# Altium schematic sheet 1_P1.schdoc.schdoc
size 604 x 431 mm; Symbol: Sheet-Symbol_A4; Device: Sheet-Symbol_A4; Company: 嘉立创EDA; Version: V1.0; Page Size: A4; @Project Name: 复刻f1c100s/f1c200sLinux; @Page Count: 1; @Update Date: 2024-04-06; @Create Date: 2023-12-01; @Schematic Name: schematic1; @Page No: 1; @Page Name: P1
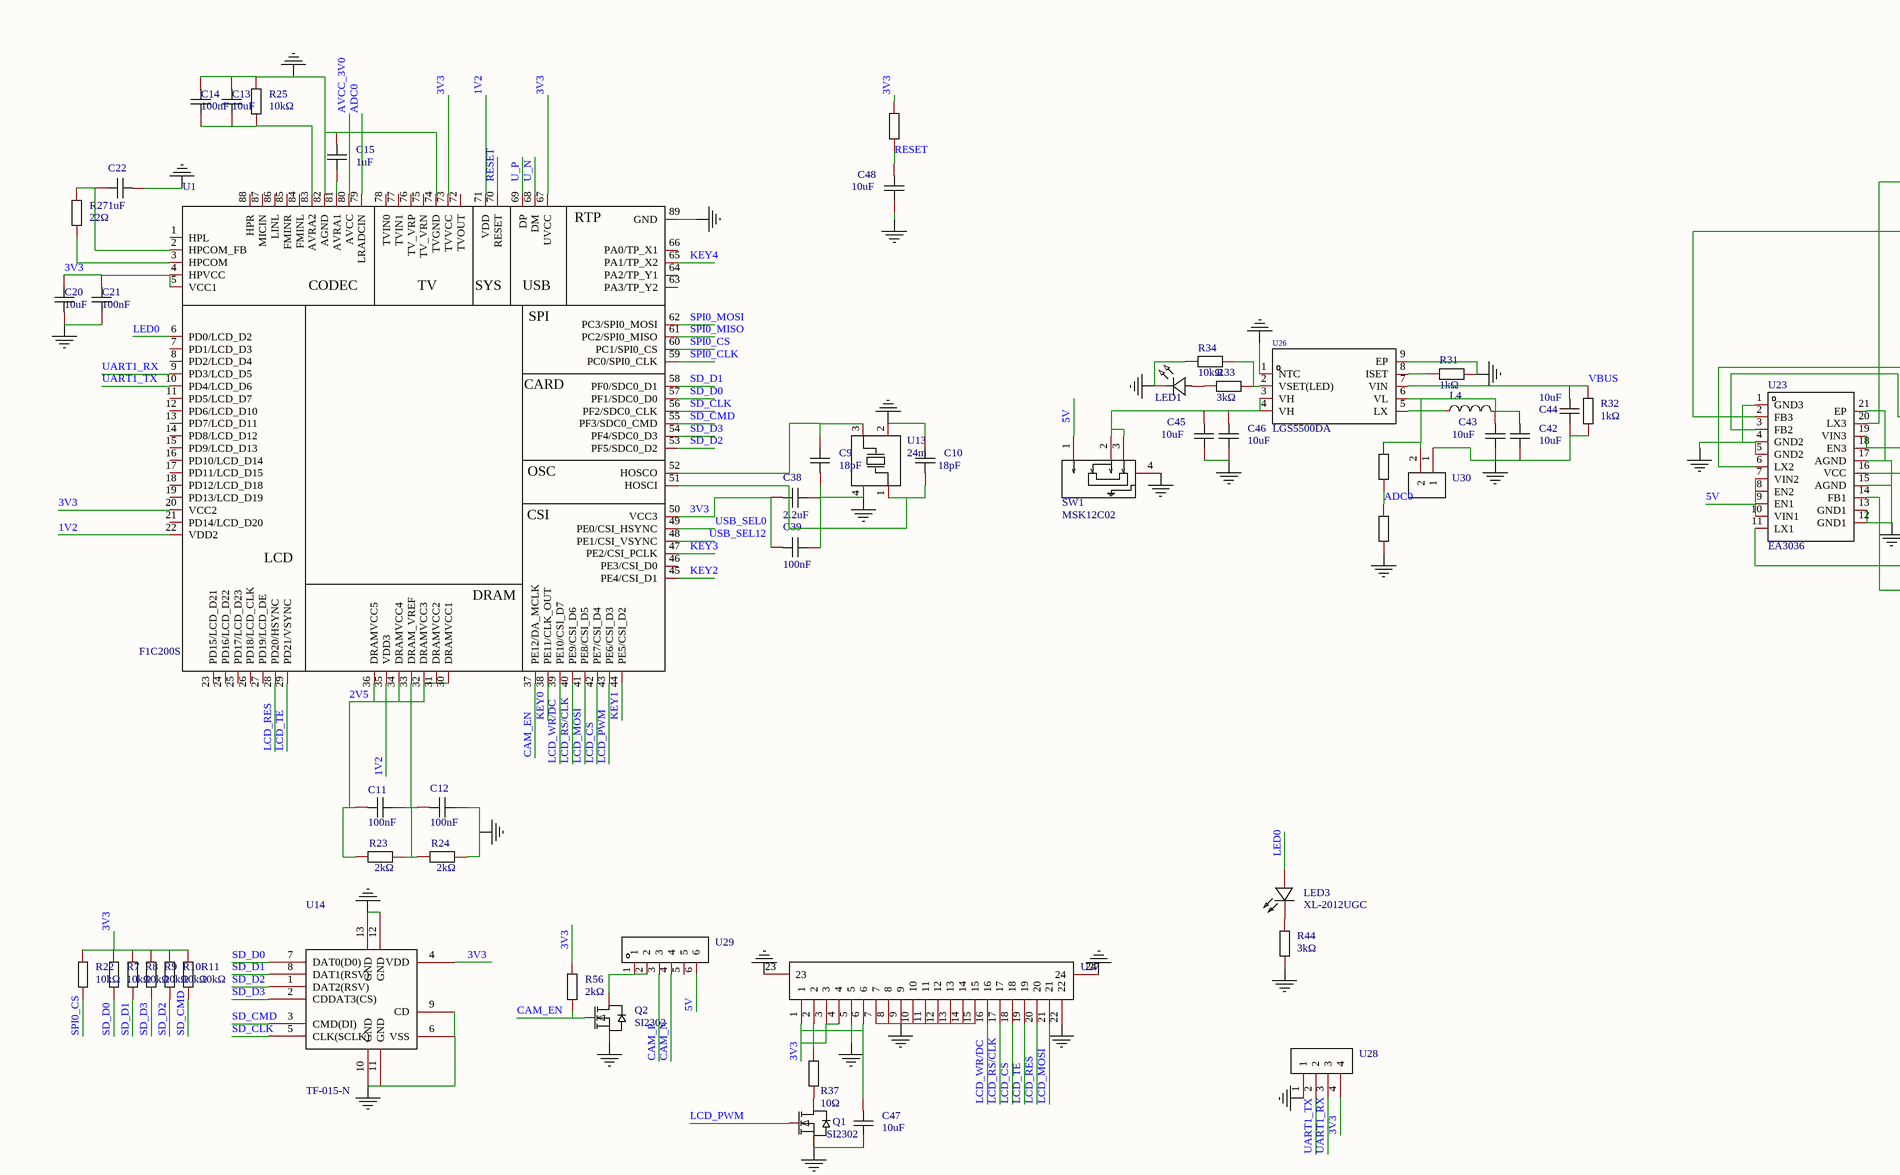
[diagram p0: 1_P1.schdoc.schdoc, top left]
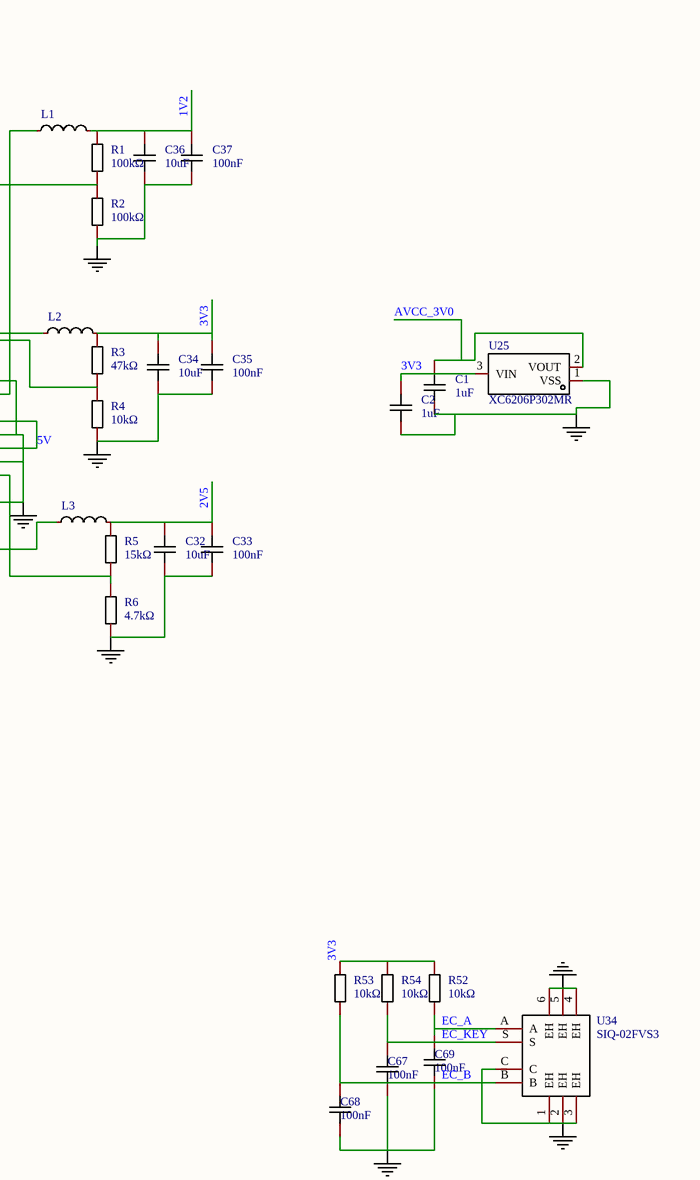
[diagram p1: 1_P1.schdoc.schdoc, top right]
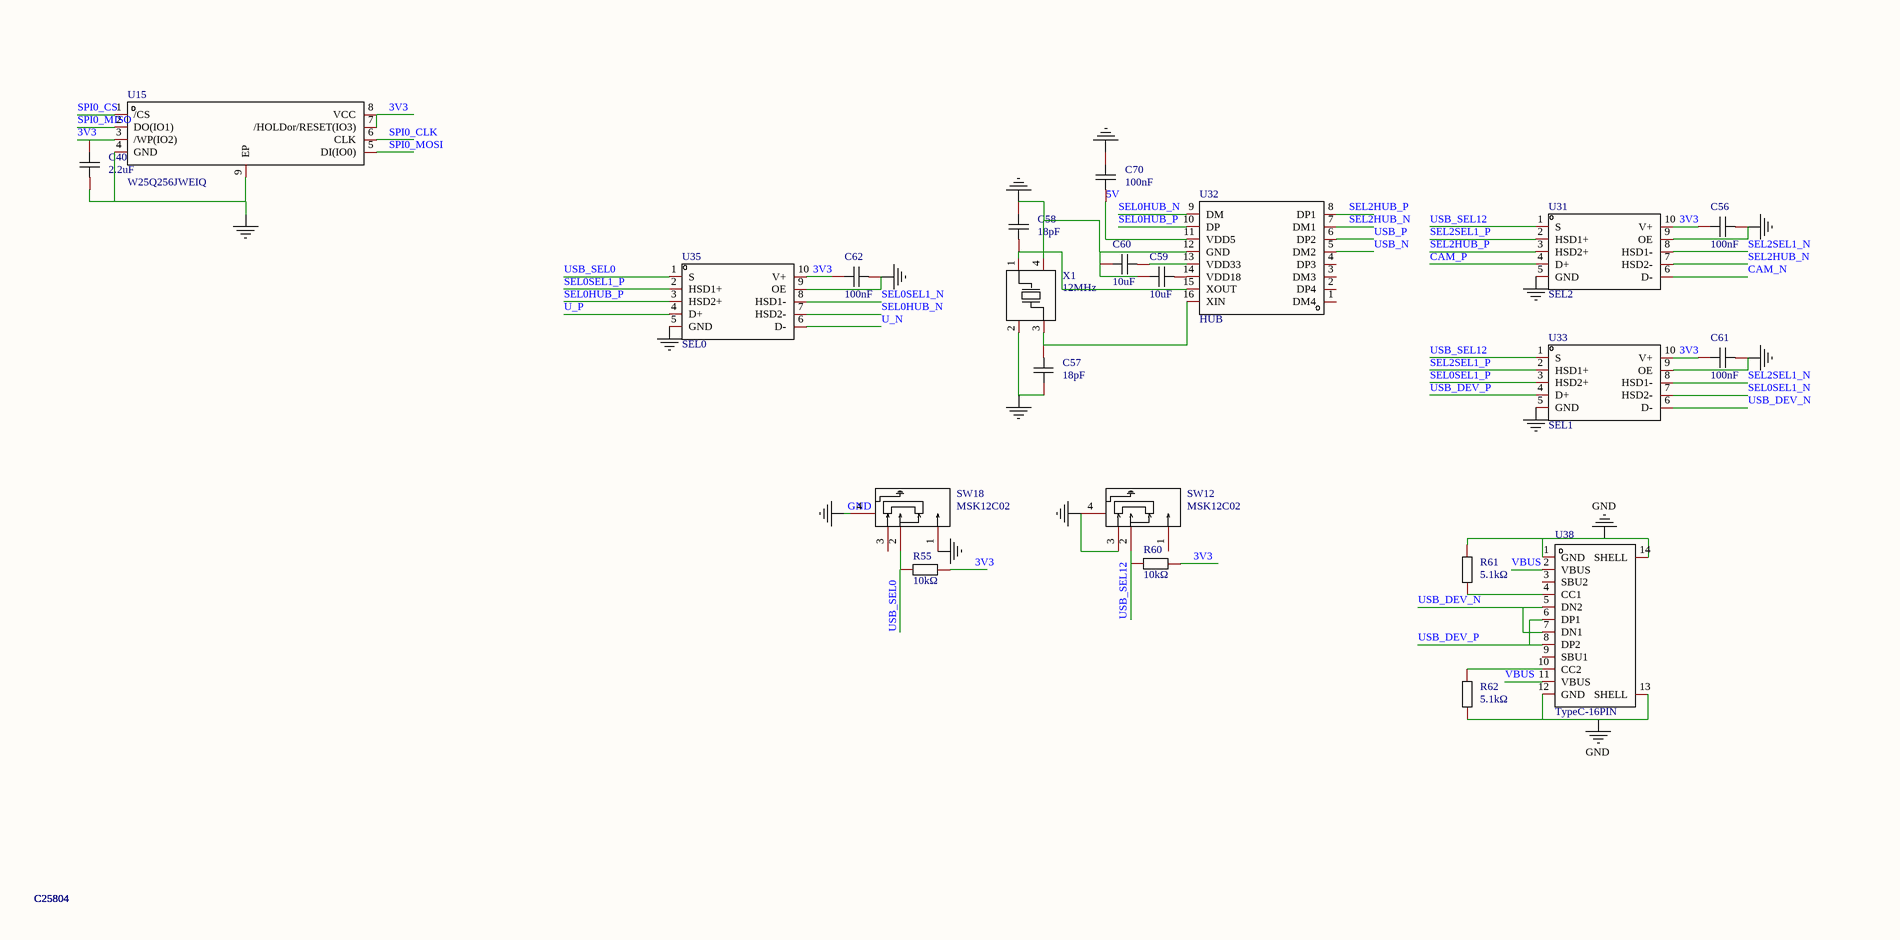
[diagram p2: 1_P1.schdoc.schdoc, bottom left]
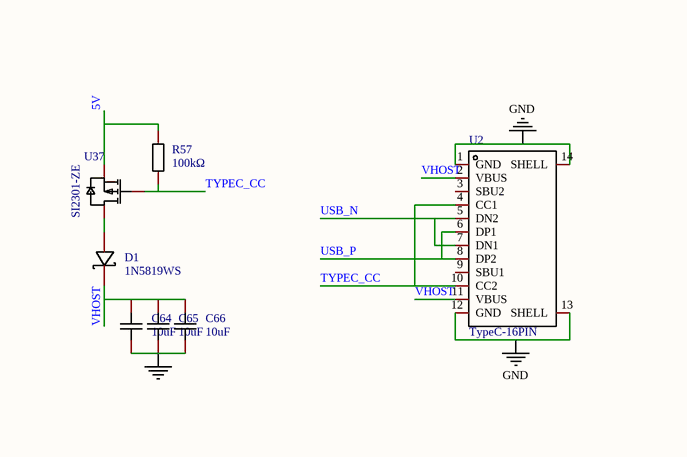
[diagram p3: 1_P1.schdoc.schdoc, bottom right]

## Parts
C1  1uF  [C0603]
C2  1uF  [C0603]
C9  18pF  [C0402]
C10  18pF  [C0402]
C11  100nF  [C0603]
C12  100nF  [C0603]
C13  10uF  [C0603]
C14  100nF  [C0603]
C15  1uF  [C0603]
C20  10uF  [C0603]
C21  100nF  [C0603]
C22  1uF  [C0603]
C32  10uF  [C0603]
C33  100nF  [C0603]
C34  10uF  [C0603]
C35  100nF  [C0603]
C36  10uF  [C0603]
C37  100nF  [C0603]
C38  2.2uF  [C0603]
C39  100nF  [C0603]
C40  2.2uF  [C0603]
C42  10uF  [C0603]
C43  10uF  [C0603]
C44  10uF  [C0603]
C45  10uF  [C0603]
C46  10uF  [C0603]
C47  10uF  [C0603]
C48  10uF  [C0603]
C56  100nF  [C0603]
C57  18pF  [C0402]
C58  18pF  [C0402]
C59  10uF  [C0603]
C60  10uF  [C0603]
C61  100nF  [C0603]
C62  100nF  [C0603]
C64  10uF  [C0603]
C65  10uF  [C0603]
C66  10uF  [C0603]
C67  100nF  [C0603]
C68  100nF  [C0603]
C69  100nF  [C0603]
C70  100nF  [C0603]
D1  1N5819WS  [SOD-323_L1.8-W1.3-LS2.5-RD]
L1  2.2uH  [IND-SMD_L2.5-W2.0_SWPA2520]  (value not drawn)
L2  2.2uH  [IND-SMD_L2.5-W2.0_SWPA2520]  (value not drawn)
L3  2.2uH  [IND-SMD_L2.5-W2.0_SWPA2520]  (value not drawn)
L4  2.2uH  [IND-SMD_L2.5-W2.0_SWPA2520]  (value not drawn)
LED1  XL-1608SURC-06  [LED0603-RD_RED]  (value not drawn)
LED3  XL-2012UGC  [LED0805-RD_GREEN]
Q1  SI2302  [SOT-23-3_L2.9-W1.3-P1.90-LS2.4-BR]
Q2  SI2302  [SOT-23-3_L2.9-W1.3-P1.90-LS2.4-BR]
R1  100kΩ  [R0603]
R2  100kΩ  [R0603]
R3  47kΩ  [R0603]
R4  10kΩ  [R0603]
R5  15kΩ  [R0603]
R6  4.7kΩ  [R0603]
R7  Supplier Part: C25804  [R0603]  (hidden comment: 10kΩ)
R8  Supplier Part: C25804  [R0603]  (hidden comment: 10kΩ)
R9  Supplier Part: C25804  [R0603]  (hidden comment: 10kΩ)
R10  Supplier Part: C25804  [R0603]  (hidden comment: 10kΩ)
R11  Supplier Part: C25804  [R0603]  (hidden comment: 10kΩ)
R12  10kΩ  [R0603]  (value not drawn)
R22  Supplier Part: C25804  [R0603]  (hidden comment: 10kΩ)
R23  2kΩ  [R0603]
R24  2kΩ  [R0603]
R25  10kΩ  [R0603]
R27  22Ω  [R0603]
R31  1kΩ  [R0603]
R32  1kΩ  [R0603]
R33  3kΩ  [R0603]
R34  10kΩ  [R0603]
R37  10Ω  [R0603]
R44  3kΩ  [R0603]
R50  10kΩ  [R0603]  (value not drawn)
R51  10kΩ  [R0603]  (value not drawn)
R52  10kΩ  [R0603]
R53  10kΩ  [R0603]
R54  10kΩ  [R0603]
R55  10kΩ  [R0603]
R56  2kΩ  [R0603]
R57  100kΩ  [R0603]
R60  10kΩ  [R0603]
R61  5.1kΩ  [R0603]
R62  5.1kΩ  [R0603]
SW1  MSK12C02  [SW-TH_MSK12C02]
SW12  MSK12C02  [SW-TH_MSK12C02]
SW18  MSK12C02  [SW-TH_MSK12C02]
U1  F1C200S  [QFN-88_L10.0-W10.0-P0.40-BL-EP6.75]
U2  TypeC-16PIN  [USB-C-SMD_TYPE-C-6PIN-2MD-073]
U13  24m  [CRYSTAL-SMD_4P-L3.2-W2.5-BL_SIT8008BI]
U14  TF-015-N  [TF-SMD_TF-015]
U15  W25Q256JWEIQ  [WSON-8_L8.0-W6.0-P1.27-TL-EP]
U23  EA3036  [QFN-20_L3.0-W3.0-P0.40-TL-EP1.7]
U25  XC6206P302MR  [SOT-23-3_L3.0-W1.7-P0.95-LS2.9-BR]
U26  LGS5500DA  [DFN-8_L2.0-W2.0-P0.50-TL-EP]
U27  2.0寸ips  [2.0寸ips]  (value not drawn)
U28  UART2.54  [uart2.54]  (value not drawn)
U29  ir  [ir]  (value not drawn)
U30  bat  [bat]  (value not drawn)
U31  SEL2  [MSOP-10_L3.0-W3.0-P0.50-LS5.0-BL]
U32  HUB  [SOP-16_L10.0-W3.9-P1.27-LS6.0-BL]
U33  SEL1  [MSOP-10_L3.0-W3.0-P0.50-LS5.0-BL]
U34  SIQ-02FVS3  [SW-SMD_SIQ-02FVS3_1]
U35  SEL0  [MSOP-10_L3.0-W3.0-P0.50-LS5.0-BL]
U37  SI2301-ZE  [SOT-23-3_L2.9-W1.3-P1.90-LS2.4-BR]
U38  TypeC-16PIN  [USB-C-SMD_TYPE-C-6PIN-2MD-073]
X1  12MHz  [OSC-SMD_4P-L3.2-W2.5-BL]

## Nets
GND: C1.1 C2.1 C9.2 C10.1 C12.1 C13.2 C14.2 C15.2 C20.2 C21.1 C22.2 C32.2 C33.2 C34.2 C35.2 C36.2 C37.2 C38.1 C39.1 C40.2 C42.1 C43.1 C44.1 C45.1 C46.1 C47.1 C48.1 C56.2 C57.1 C58.1 C59.1 C60.1 C61.2 C62.2 C64.2 C65.2 C66.2 C67.1 C68.1 C69.1 C70.1 LED1.1(K) Q1.2(S) Q2.2(S) R2.1 R4.1 R6.1 R24.2 R25.1 R31.2 R32.1 R34.1 R44.2 R51.1 R61.1 R62.1 SW1.4 SW12.3 SW12.4 SW18.1 SW18.4 U1.74(TVGND) U1.82(AGND) U1.89(GND) U2.1(GND) U2.12(GND) U2.13(SHELL) U2.14(SHELL) U13.2(GND) U13.4(GND) U14.6(VSS) U14.9(CD) U14.10(GND) U14.11(GND) U14.12(GND) U14.13(GND) U15.4(GND) U15.9(EP) U23.1(GND3) U23.4(GND2) U23.5(GND2) U23.12(GND1) U23.13(GND1) U23.15(AGND) U23.17(AGND) U23.21(EP) U25.1(VSS) U26.1(NTC) U26.9(EP) U27.5 U27.7 U27.8 U27.9 U27.10 U27.11 U27.12 U27.13 U27.14 U27.15 U27.22 U27.23 U27.24 U28.1 U30.1 U31.5(GND) U31.9(OE) U32.12(GND) U33.5(GND) U33.9(OE) U34.1(EH) U34.2(EH) U34.3(EH) U34.4(EH) U34.5(EH) U34.6(EH) U34.C U35.5(GND) U35.9(OE) U38.1(GND) U38.12(GND) U38.13(SHELL) U38.14(SHELL) X1.2(GND) X1.4(GND)
1V2: C36.1 C37.1 L1.2 R1.2 U1.22(VDD2) U1.35(VDD3) U1.71(VDD)
2V5: C11.2 C32.1 C33.1 L3.2 R5.2 R23.1 U1.30(DRAMVCC1) U1.31(DRAMVCC2) U1.32(DRAMVCC3) U1.34(DRAMVCC4) U1.36(DRAMVCC5)
3V3: C2.2 C20.1 C21.2 C34.1 C35.1 C38.2 C39.2 C40.1 C47.2 C56.1 C61.1 C62.1 L2.2 R3.2 R7.2 R8.2 R9.2 R10.2 R11.2 R12.2 R22.2 R52.2 R53.2 R54.2 R55.1 R56.2 R60.1 U1.4(HPVCC) U1.5(VCC1) U1.20(VCC2) U1.50(VCC3) U1.67(UVCC) U1.73(TVVCC) U14.4(VDD) U15.3(/WP(IO2)) U15.7(/HOLDor/RESET(IO3)) U15.8(VCC) U25.3(VIN) U27.1 U27.3 U27.4 U27.6 U28.4 U31.10(V+) U33.10(V+) U35.10(V+)
5V: C70.2 R57.1 SW1.1 U23.7(VIN2) U23.8(EN2) U23.9(EN1) U23.10(VIN1) U23.16(VCC) U23.18(EN3) U23.19(VIN3) U29.6 U32.11(VDD5) U37.2(S)
ADC0: R50.1 R51.2 U1.79(LRADCIN)
AVCC_3V0: C1.2 U1.80(AVCC) U25.2(VOUT)
CAM_EN: Q2.1(G) R56.1 U1.37(PE12/DA_MCLK)
CAM_N: U29.4 U31.6(D-)
CAM_P: U29.3 U31.4(D+)
EC_A: C69.2 R52.1 U34.A
EC_B: C68.2 R53.1 U34.B
EC_KEY: C67.2 R54.1 U34.S
KEY0: U1.38(PE11/CLK_OUT)
KEY1: U1.44(PE5/CSI_D2)
KEY2: U1.45(PE4/CSI_D1)
KEY3: U1.47(PE2/CSI_PCLK)
KEY4: U1.65(PA1/TP_X2)
LCD_CS: U1.42(PE7/CSI_D4) U27.18
LCD_MOSI: U1.41(PE8/CSI_D5) U27.21
LCD_PWM: Q1.1(G) U1.43(PE6/CSI_D3)
LCD_RES: U1.28(PD20/HSYNC) U27.20
LCD_RS/CLK: U1.40(PE9/CSI_D6) U27.17
LCD_TE: U1.29(PD21/VSYNC) U27.19
LCD_WR/DC: U1.39(PE10/CSI_D7) U27.16
LED0: LED3.1(+) U1.6(PD0/LCD_D2)
RESET: C48.2 R12.1 U1.70(RESET)
SD_CLK: U1.56(PF2/SDC0_CLK) U14.5(CLK(SCLK))
SD_CMD: R11.1 U1.55(PF3/SDC0_CMD) U14.3(CMD(DI))
SD_D0: R7.1 U1.57(PF1/SDC0_D0) U14.7(DAT0(D0))
SD_D1: R8.1 U1.58(PF0/SDC0_D1) U14.8(DAT1(RSV))
SD_D2: R10.1 U1.53(PF5/SDC0_D2) U14.1(DAT2(RSV))
SD_D3: R9.1 U1.54(PF4/SDC0_D3) U14.2(CDDAT3(CS))
SEL0HUB_N: U32.9(DM) U35.7(HSD2-)
SEL0HUB_P: U32.10(DP) U35.3(HSD2+)
SEL0SEL1_N: U33.7(HSD2-) U35.8(HSD1-)
SEL0SEL1_P: U33.3(HSD2+) U35.2(HSD1+)
SEL2HUB_N: U31.7(HSD2-) U32.7(DM1)
SEL2HUB_P: U31.3(HSD2+) U32.8(DP1)
SEL2SEL1_N: U31.8(HSD1-) U33.8(HSD1-)
SEL2SEL1_P: U31.2(HSD1+) U33.2(HSD1+)
SPI0_CLK: U1.59(PC0/SPI0_CLK) U15.6(CLK)
SPI0_CS: R22.1 U1.60(PC1/SPI0_CS) U15.1(/CS)
SPI0_MISO: U1.61(PC2/SPI0_MISO) U15.2(DO(IO1))
SPI0_MOSI: U1.62(PC3/SPI0_MOSI) U15.5(DI(IO0))
TYPEC_CC: R57.2 U2.4(CC1) U2.10(CC2) U37.1(G)
U_N: U1.68(DM) U35.6(D-)
U_P: U1.69(DP) U35.4(D+)
UART1_RX: U1.9(PD3/LCD_D5) U28.3
UART1_TX: U1.10(PD4/LCD_D6) U28.2
USB_DEV_N: U33.6(D-) U38.5(DN2) U38.7(DN1)
USB_DEV_P: U33.4(D+) U38.6(DP1) U38.8(DP2)
USB_N: U2.5(DN2) U2.7(DN1) U32.5(DM2)
USB_P: U2.6(DP1) U2.8(DP2) U32.6(DP2)
USB_SEL0: R55.2 SW18.2 U1.49(PE0/CSI_HSYNC) U35.1(S)
USB_SEL12: R60.2 SW12.2 U1.48(PE1/CSI_VSYNC) U31.1(S) U33.1(S)
VBUS: C44.2 R32.2 U26.7(VIN) U38.2(VBUS) U38.11(VBUS)
VHOST: C64.1 C65.1 C66.1 D1.1(K) U2.2(VBUS) U2.11(VBUS)
NetC9_1: C9.1 U1.52(HOSCO) U13.3(OSC2)
NetC10_2: C10.2 U1.51(HOSCI) U13.1(OSC1)
NetC11_1: C11.1 C12.2 R23.2 R24.1 U1.33(DRAM_VREF)
NetC13_1: C13.1 C14.1 R25.2 U1.83(AVRA2)
NetC15_1: C15.1 U1.81(AVRA1)
NetC22_1: C22.1 R27.2 U1.2(HPCOM_FB)
NetC42_2: C42.2 C43.2 L4.2 R50.2 U26.6(VL) U30.2
NetC45_2: C45.2 C46.2 SW1.2 SW1.3 U26.3(VH) U26.4(VH)
NetC57_2: C57.2 U32.16(XIN) X1.3(OSC2)
NetC58_2: C58.2 U32.15(XOUT) X1.1(OSC1)
NetC59_2: C59.2 U32.14(VDD18)
NetC60_2: C60.2 U32.13(VDD33)
NetD1_2: D1.2(A) U37.3(D)
NetL1_1: L1.1 U23.20(LX3)
NetL2_1: L2.1 U23.6(LX2)
NetL3_1: L3.1 U23.11(LX1)
NetL4_1: L4.1 U26.5(LX)
NetLED1_2: LED1.2(A) R33.2
NetLED3_2: LED3.2(-) R44.1
NetQ1_3: Q1.3(D) R37.1
NetQ2_3: Q2.3(D) U29.1 U29.2
NetR1_1: R1.1 R2.2 U23.2(FB3)
NetR3_1: R3.1 R4.2 U23.3(FB2)
NetR5_1: R5.1 R6.2 U23.14(FB1)
NetR27_1: R27.1 U1.3(HPCOM)
NetR31_1: R31.1 U26.8(ISET)
NetR33_1: R33.1 R34.2 U26.2(VSET(LED))
NetR37_2: R37.2 U27.2
NetR61_2: R61.2 U38.4(CC1)
NetR62_2: R62.2 U38.10(CC2)

Not connected (* = marked no-connect by the designer): SW12 1; SW18 3; U1 1(HPL) 7(PD1/LCD_D3) 8(PD2/LCD_D4) 11(PD5/LCD_D7) 12(PD6/LCD_D10) 13(PD7/LCD_D11) 14(PD8/LCD_D12) 15(PD9/LCD_D13) 16(PD10/LCD_D14) 17(PD11/LCD_D15) 18(PD12/LCD_D18) 19(PD13/LCD_D19) 21(PD14/LCD_D20) 23(PD15/LCD_D21) 24(PD16/LCD_D22) 25(PD17/LCD_D23) 26(PD18/LCD_CLK) 27(PD19/LCD_DE) 46(PE3/CSI_D0) 63(PA3/TP_Y2) 64(PA2/TP_Y1) 66(PA0/TP_X1) 72(TVOUT) 75(TV_VRN) 76(TV_VRP) 77(TVIN1) 78(TVIN0) 84(FMINL) 85(FMINR) 86(LINL) 87(MICIN) 88(HPR); U2 3(SBU2) 9(SBU1); U29 5; U32 1(DM4) 2(DP4) 3(DM3) 4(DP3); U38 3(SBU2) 9(SBU1)

## Notes on the sheet
- 1
- 2
- 3
- 4
- 5
- 6
- A
- B
- C
- D
- Schematic
- schematic1
- Create Date
- Update Date
- 2024-04-06
- 2023-12-01
- Reviewed
- Drawed
- Page
- P1
- Part Number
- 复刻f1c100s/f1c200sLinux
- VER
- SIZE
- PAGE
- OF
- V1.0
- A4
- 嘉立创EDA
- (in symbol F1C200S) RTP; CODEC; TV; SYS; USB; SPI; CARD; OSC; CSI; LCD; DRAM

## Library data of the parts
C1 C2 C15 C22 = CL10A105KB8NNNC: Manufacturer: SAMSUNG(三星); Symbol: C1608JB1C105K080AA; Add into BOM: yes; Tolerance: ±10%; Voltage Rated: 50V; Temperature Coefficient: X5R; Description: 容值:1uF;精度:±10%;额定电压:50V;材质(温度系数):X5R;; Name: 1uF; Device: CL10A105KB8NNNC; LCSC Part Name: 1uF ±10% 50V; Supplier Part: C15849; Manufacturer Part: CL10A105KB8NNNC; Supplier Footprint: 0603; JLCPCB Part Class: Basic Part; Datasheet: https://atta.szlcsc.com/upload/public/pdf/source/20160218/1457707763339.pdf; Supplier: LCSC; Convert to PCB: yes; Value: 1uF
C9 C10 C57 C58 = 0402CG180J500NT: Manufacturer: FH(风华); Symbol: C1608JB1C105K080AA; Add into BOM: yes; Tolerance: ±5%; Voltage Rated: 50V; Temperature Coefficient: C0G; Description: 容值:18pF;精度:±5%;额定电压:50V;材质(温度系数):C0G;; Name: 18pF; Device: 0402CG180J500NT; LCSC Part Name: 18pF ±5% 50V; Supplier Part: C1549; Manufacturer Part: 0402CG180J500NT; Supplier Footprint: 0402; JLCPCB Part Class: Basic Part; Datasheet: https://atta.szlcsc.com/upload/public/pdf/source/20200305/C486355_26A10D38EF8C2A5C37091D0039909270.pdf; Supplier: LCSC; Convert to PCB: yes; Value: 18pF
C11 C12 = 0603B104K500NT: Manufacturer: FH(风华); Symbol: CL05A106MQ5NUNZ; Add into BOM: yes; Tolerance: ±10%; Voltage Rated: 50V; Temperature Coefficient: X7R; Description: 容值:100nF;精度:±10%;额定电压:50V;材质(温度系数):X7R;; Name: 100nF; Device: 0603B104K500NT; LCSC Part Name: 100nF ±10% 50V; Supplier Part: C30926; Manufacturer Part: 0603B104K500NT; Supplier Footprint: 0603; JLCPCB Part Class: Extended Part; Datasheet: https://atta.szlcsc.com/upload/public/pdf/source/20200305/C486355_26A10D38EF8C2A5C37091D0039909270.pdf; Supplier: LCSC; Convert to PCB: yes; Value: 100nF
C13 = CL10A106MA8NRNC: Manufacturer: SAMSUNG(三星); Symbol: C1608JB1C105K080AA; Add into BOM: yes; Tolerance: ±20%; Voltage Rated: 25V; Temperature Coefficient: X5R; Description: 容值:10uF;精度:±20%;额定电压:25V;材质(温度系数):X5R;; Name: 10uF; Device: CL10A106MA8NRNC; LCSC Part Name: 10uF ±20% 25V; Supplier Part: C96446; Manufacturer Part: CL10A106MA8NRNC; Supplier Footprint: 0603; JLCPCB Part Class: Basic Part; Datasheet: https://atta.szlcsc.com/upload/public/pdf/source/20160218/1457707763339.pdf; Supplier: LCSC; Convert to PCB: yes; Value: 10uF
C14 = 0603B104K500NT: Manufacturer: FH(风华); Symbol: C1608JB1C105K080AA; Add into BOM: yes; Tolerance: ±10%; Voltage Rated: 50V; Temperature Coefficient: X7R; Description: 容值:100nF;精度:±10%;额定电压:50V;材质(温度系数):X7R;; Name: 100nF; Device: 0603B104K500NT; LCSC Part Name: 100nF ±10% 50V; Supplier Part: C30926; Manufacturer Part: 0603B104K500NT; Supplier Footprint: 0603; JLCPCB Part Class: Extended Part; Datasheet: https://atta.szlcsc.com/upload/public/pdf/source/20200305/C486355_26A10D38EF8C2A5C37091D0039909270.pdf; Supplier: LCSC; Convert to PCB: yes; Value: 100nF
C20 = CL10A106MA8NRNC: Manufacturer: SAMSUNG(三星); Symbol: CGB2A1X6S1A105M033BC; Add into BOM: yes; Tolerance: ±20%; Voltage Rated: 25V; Temperature Coefficient: X5R; Description: 容值:10uF;精度:±20%;额定电压:25V;材质(温度系数):X5R;; Name: 10uF; Device: CL10A106MA8NRNC; LCSC Part Name: 10uF ±20% 25V; Supplier Part: C96446; Manufacturer Part: CL10A106MA8NRNC; Supplier Footprint: 0603; JLCPCB Part Class: Basic Part; Datasheet: https://atta.szlcsc.com/upload/public/pdf/source/20160218/1457707763339.pdf; Supplier: LCSC; Convert to PCB: yes; Value: 10uF
C21 C67-C69 = 0603B104K500NT: Manufacturer: FH(风华); Symbol: CGB2A1X6S1A105M033BC; Add into BOM: yes; Tolerance: ±10%; Voltage Rated: 50V; Temperature Coefficient: X7R; Description: 容值:100nF;精度:±10%;额定电压:50V;材质(温度系数):X7R;; Name: 100nF; Device: 0603B104K500NT; LCSC Part Name: 100nF ±10% 50V; Supplier Part: C30926; Manufacturer Part: 0603B104K500NT; Supplier Footprint: 0603; JLCPCB Part Class: Extended Part; Datasheet: https://atta.szlcsc.com/upload/public/pdf/source/20200305/C486355_26A10D38EF8C2A5C37091D0039909270.pdf; Supplier: LCSC; Convert to PCB: yes; Value: 100nF
C32 C34 C36 C64-C66 = CL10A106MA8NRNC: Manufacturer: SAMSUNG(三星); Symbol: CC0603KRX7R9BB104; Add into BOM: yes; Tolerance: ±20%; Voltage Rated: 25V; Temperature Coefficient: X5R; Description: 容值:10uF;精度:±20%;额定电压:25V;材质(温度系数):X5R;; Name: 10uF; Device: CL10A106MA8NRNC; LCSC Part Name: 10uF ±20% 25V; Supplier Part: C96446; Manufacturer Part: CL10A106MA8NRNC; Supplier Footprint: 0603; JLCPCB Part Class: Basic Part; Datasheet: https://atta.szlcsc.com/upload/public/pdf/source/20160218/1457707763339.pdf; Supplier: LCSC; Convert to PCB: yes; Value: 10uF
C33 C35 C37 C39 C56 C61 C62 C70 = 0603B104K500NT: Manufacturer: FH(风华); Symbol: CC0603KRX7R9BB104; Add into BOM: yes; Tolerance: ±10%; Voltage Rated: 50V; Temperature Coefficient: X7R; Description: 容值:100nF;精度:±10%;额定电压:50V;材质(温度系数):X7R;; Name: 100nF; Device: 0603B104K500NT; LCSC Part Name: 100nF ±10% 50V; Supplier Part: C30926; Manufacturer Part: 0603B104K500NT; Supplier Footprint: 0603; JLCPCB Part Class: Extended Part; Datasheet: https://atta.szlcsc.com/upload/public/pdf/source/20200305/C486355_26A10D38EF8C2A5C37091D0039909270.pdf; Supplier: LCSC; Convert to PCB: yes; Value: 100nF
C38 C40 = CL10A225KO8NNNC: Manufacturer: SAMSUNG(三星); Symbol: CC0603KRX7R9BB104; Add into BOM: yes; Tolerance: ±10%; Voltage Rated: 16V; Temperature Coefficient: X5R; Description: 容值:2.2uF;精度:±10%;额定电压:16V;材质(温度系数):X5R;; Name: 2.2uF; Device: CL10A225KO8NNNC; LCSC Part Name: 2.2uF ±10% 16V; Supplier Part: C23630; Manufacturer Part: CL10A225KO8NNNC; Supplier Footprint: 0603; JLCPCB Part Class: Basic Part; Datasheet: https://atta.szlcsc.com/upload/public/pdf/source/20160218/1457707763339.pdf; Supplier: LCSC; Convert to PCB: yes; Value: 2.2uF
C42-C48 C59 C60 = CL10A106MA8NRNC: Manufacturer: SAMSUNG(三星); Symbol: CL10A106KP8NNNC; Add into BOM: yes; Tolerance: ±20%; Voltage Rated: 25V; Temperature Coefficient: X5R; Description: 容值:10uF;精度:±20%;额定电压:25V;材质(温度系数):X5R;; Name: 10uF; Device: CL10A106MA8NRNC; Supplier: LCSC; Manufacturer Part: CL10A106MA8NRNC; Value: 10uF; Supplier Part: C96446; JLCPCB Part Class: Basic Part; LCSC Part Name: 10uF ±20% 25V; Supplier Footprint: 0603; Datasheet: https://atta.szlcsc.com/upload/public/pdf/source/20160218/1457707763339.pdf; Convert to PCB: yes
D1 = 1N5819WS_C191023: Manufacturer: Hottech(合科泰); Add into BOM: yes; Forward Voltage (Vf@If): 600mV@1A; Reverse Voltage (Vr): 40V; Average Rectified Current (Io): 1A; Description: 正向压降(Vf):600mV@1A;直流反向耐压(Vr):40V;平均整流电流(Io):1A;; Name: 1N5819WS; Symbol: 1N5819WS; Device: 1N5819WS_C191023; Supplier: LCSC; Supplier Part: C191023; Manufacturer Part: 1N5819WS; JLCPCB Part Class: 基础库; LCSC Part Name: 电压:40V 电流:1A; Supplier Footprint: SOD-323; Datasheet: https://atta.szlcsc.com/upload/public/pdf/source/20220428/3CB86FD8D28D653594B4E35F9D5AEFD9.pdf; Convert to PCB: yes
L1-L4 = CMLW252012S2R2MST: Manufacturer: Cybermax(思博科技); Add into BOM: yes; Tolerance: ±20%; Rated Current: 1.85A; DC Resistance (DCR): 130mΩ; Description: 电感值:2.2uH;精度:±20%;额定电流:1.85A;直流电阻(DCR):130mΩ;; Name: 2.2uH; Symbol: CMLW252012S2R2MST; Device: CMLW252012S2R2MST; LCSC Part Name: 2.2uH ±20% 1.85A 130mΩ; Supplier Part: C411361; Manufacturer Part: CMLW252012S2R2MST; Supplier Footprint: SMD; JLCPCB Part Class: Extended Part; Datasheet: https://atta.szlcsc.com/upload/public/pdf/source/20190812/C411361_857CB3F99B232DE0F7EEA04983950F98.pdf; Supplier: LCSC; Convert to PCB: yes; Value: 2.2uH
LED1 = XL-1608SURC-06: Manufacturer: XINGLIGHT(成兴光); Add into BOM: yes; Emitted Color: 红灯; Lens Color: 无色透明; Dominant Wavelength: 617nm~621nm; Peak Wavelength: 623nm; Forward Current: 25mA; Power Dissipation: 55mW; Viewing Angle: 120°; Mounting Sytle: 正贴; Description: 发光颜色:红灯;主波长:617nm~621nm;色温:-;功率:55mW;安装方式:正贴;; Name: XL-1608SURC-06; Symbol: XL-1608SURC-06; Device: XL-1608SURC-06; LCSC Part Name: 红灯 正贴; Supplier Part: C965799; Manufacturer Part: XL-1608SURC-06; Supplier Footprint: 0603; JLCPCB Part Class: Extended Part; Datasheet: https://atta.szlcsc.com/upload/public/pdf/source/20221102/D860AFDD1CDB02C5A8064103A32707E2.pdf; Supplier: LCSC; Convert to PCB: yes; Color Temperature: -; Operating Temperature: -30℃~+85℃
LED3 = XL-2012UGC: Manufacturer: XINGLIGHT(成兴光); Symbol: FC-2012HRK-620D; Add into BOM: yes; Emitted Color: 翠绿; Lens Color: 无色透明; Dominant Wavelength: 516nm~525nm; Peak Wavelength: 534nm; Forward Current: 25mA; Power Dissipation: 80mW; Viewing Angle: 120°; Mounting Sytle: 正贴; Description: 发光颜色:翠绿;主波长:516nm~525nm;色温:-;功率:80mW;安装方式:正贴;; Forward Voltage (VF): 1.6V~2.6V; Luminous Intensity: 67mcd~195mcd; Name: XL-2012UGC; Device: XL-2012UGC; Supplier: LCSC; Manufacturer Part: XL-2012UGC; Supplier Part: C965815; JLCPCB Part Class: Extended Part; LCSC Part Name: 翠绿 正贴; Supplier Footprint: 0805; Datasheet: https://atta.szlcsc.com/upload/public/pdf/source/20221102/ACA6CBC413A1A8AF38BEBA54306464BE.pdf; Convert to PCB: yes; Color Temperature: -; Operating Temperature: -30℃~+85℃; Diode Configuration: -; Lamp Holder Type: -
Q1 Q2 = SI2302: Manufacturer: TECH PUBLIC(台舟); Symbol: SI2302_C2841377; Add into BOM: yes; Type: N沟道; Drain Source Voltage (Vdss): 20V; Continuous Drain Current (Id): 2.6A; Power Dissipation (Pd): 900mW; Drain Source On Resistance (RDS(on)@Vgs,Id): 85mΩ@4.5V,2.6A; Gate Threshold Voltage (Vgs(th)@Id): 1.5V@250uA; Input Capacitance (Ciss@Vds): 880pF@6V; Description: 类型:N沟道;漏源电压(Vdss):20V;连续漏极电流(Id):2.6A;功率(Pd):900mW;导通电阻(RDS(on)@Vgs,Id):85mΩ@4.5V,2.6A;阈值电压(Vgs(th)@Id):1.5V@250uA;栅极电荷(Qg@Vgs):-;输入电容(Ciss@Vds):880pF@6V;反向传输电容(Crss@Vds):-;工作温度:+150℃@(Tj);; Name: SI2302; Device: SI2302; LCSC Part Name: N沟道 20V 2.6A; Supplier Part: C2841377; Manufacturer Part: SI2302; Supplier Footprint: SOT-23-3; JLCPCB Part Class: Extended Part; Datasheet: https://atta.szlcsc.com/upload/public/pdf/source/20210810/B45106B571BB908B9120BCB1C1283335.pdf; Supplier: LCSC; Convert to PCB: yes; Total Gate Charge (Qg@Vgs): -; Reverse Transfer Capacitance (Crss@Vds): -; Operating Temperature: +150℃@(Tj)
R1 R2 = RC0603FR-07100KL: Manufacturer: YAGEO(国巨); Symbol: 电阻; Add into BOM: yes; Tolerance: ±1%; Power(Watts): 100mW; Temperature Coefficient: ±100ppm/℃; Overload Voltage (Max): 75V; Description: 电阻类型:厚膜电阻;阻值:100kΩ;精度:±1%;功率:100mW;温度系数:±100ppm/℃;; Name: 100kΩ; Device: RC0603FR-07100KL; LCSC Part Name: 厚膜电阻 100kΩ ±1% 100mW; Supplier Part: C14675; Manufacturer Part: RC0603FR-07100KL; Supplier Footprint: 0603; JLCPCB Part Class: Extended Part; Datasheet: https://atta.szlcsc.com/upload/public/pdf/source/20140324/1457707028752.pdf; Supplier: LCSC; Convert to PCB: yes; Type: 厚膜电阻; Value: 100kΩ; Operating Temperature Range: -55℃~+155℃
R3 = 0603WAF4702T5E: Manufacturer: UNI-ROYAL(厚声); Symbol: 电阻; Add into BOM: yes; Tolerance: ±1%; Power(Watts): 100mW; Overload Voltage (Max): 75V; Temperature Coefficient: ±100ppm/℃; Description: 阻值:47kΩ;精度:±1%;功率:100mW;温度系数:±100ppm/℃;电阻类型:厚膜电阻;; Name: 47kΩ; Device: 0603WAF4702T5E; LCSC Part Name: 47kΩ ±1% 100mW 厚膜电阻; Supplier Part: C25819; Manufacturer Part: 0603WAF4702T5E; Supplier Footprint: 0603; JLCPCB Part Class: Basic Part; Datasheet: https://atta.szlcsc.com/upload/public/pdf/source/20200306/C422600_1E6D84923E4A46A82E41ADD87F860B5C.pdf; Supplier: LCSC; Convert to PCB: yes; Value: 47kΩ; Type: 厚膜电阻; Operating Temperature Range: -55℃~+155℃
R4 R7-R12 R22 R50 R51 R55 R60 = 0603WAF1002T5E: 阻值:10kΩ;精度:±1%;功率:100mW;温度系数:±100ppm/℃;电阻类型:厚膜电阻;; Manufacturer: UNI-ROYAL(厚声); Symbol: 电阻; Add into BOM: yes; Tolerance: ±1%; Power(Watts): 100mW; Overload Voltage (Max): 75V; Name: 10kΩ; Device: 0603WAF1002T5E; LCSC Part Name: 10kΩ ±1% 100mW 厚膜电阻; Manufacturer Part: 0603WAF1002T5E; Supplier Footprint: 0603; JLCPCB Part Class: Basic Part; Datasheet: https://atta.szlcsc.com/upload/public/pdf/source/20200306/C422600_1E6D84923E4A46A82E41ADD87F860B5C.pdf; Supplier: LCSC; Convert to PCB: yes; Type: 厚膜电阻; Value: 10kΩ; Temperature Coefficient: ±100ppm/℃; Operating Temperature Range: -55℃~+155℃
  R4 R12 R50 R51 R55 R60: Supplier Part: C25804
R5 = 0603WAF1502T5E: Manufacturer: UNI-ROYAL(厚声); Symbol: 电阻; Add into BOM: yes; Tolerance: ±1%; Power(Watts): 100mW; Overload Voltage (Max): 75V; Temperature Coefficient: ±100ppm/℃; Description: 阻值:15kΩ;精度:±1%;功率:100mW;温度系数:±100ppm/℃;电阻类型:厚膜电阻;; Name: 15kΩ; Device: 0603WAF1502T5E; LCSC Part Name: 15kΩ ±1% 100mW 厚膜电阻; Supplier Part: C22809; Manufacturer Part: 0603WAF1502T5E; Supplier Footprint: 0603; JLCPCB Part Class: Basic Part; Datasheet: https://atta.szlcsc.com/upload/public/pdf/source/20200306/C422600_1E6D84923E4A46A82E41ADD87F860B5C.pdf; Supplier: LCSC; Convert to PCB: yes; Value: 15kΩ; Type: 厚膜电阻; Operating Temperature Range: -55℃~+155℃
R6 = 0603WAF4701T5E: Manufacturer: UNI-ROYAL(厚声); Symbol: 电阻; Add into BOM: yes; Tolerance: ±1%; Power(Watts): 100mW; Overload Voltage (Max): 75V; Temperature Coefficient: ±100ppm/℃; Description: 阻值:4.7kΩ;精度:±1%;功率:100mW;温度系数:±100ppm/℃;电阻类型:厚膜电阻;; Name: 4.7kΩ; Device: 0603WAF4701T5E; LCSC Part Name: 4.7kΩ ±1% 100mW 厚膜电阻; Supplier Part: C23162; Manufacturer Part: 0603WAF4701T5E; Supplier Footprint: 0603; JLCPCB Part Class: Basic Part; Datasheet: https://atta.szlcsc.com/upload/public/pdf/source/20200306/C422600_1E6D84923E4A46A82E41ADD87F860B5C.pdf; Supplier: LCSC; Convert to PCB: yes; Value: 4.7kΩ; Type: 厚膜电阻; Operating Temperature Range: -55℃~+155℃
R23 R24 R56 = 0603WAF2001T5E: 阻值:2kΩ;精度:±1%;功率:100mW;温度系数:±100ppm/℃;电阻类型:厚膜电阻;; Manufacturer: UNI-ROYAL(厚声); Symbol: AC0402FR-0710KL; Add into BOM: yes; Tolerance: ±1%; Power(Watts): 100mW; Overload Voltage (Max): 75V; Name: 2kΩ; Device: 0603WAF2001T5E; LCSC Part Name: 2kΩ ±1% 100mW 厚膜电阻; Supplier Part: C22975; Manufacturer Part: 0603WAF2001T5E; Supplier Footprint: 0603; JLCPCB Part Class: Basic Part; Datasheet: https://atta.szlcsc.com/upload/public/pdf/source/20200306/C422600_1E6D84923E4A46A82E41ADD87F860B5C.pdf; Supplier: LCSC; Convert to PCB: yes; Value: 2kΩ; Temperature Coefficient: ±100ppm/℃; Type: 厚膜电阻; Operating Temperature Range: -55℃~+155℃
R25 R34 R52-R54 R57 = 0603WAF1002T5E: Manufacturer: UNI-ROYAL(厚声); Add into BOM: yes; Tolerance: ±1%; Power(Watts): 100mW; Temperature Coefficient: ±100ppm/℃; Overload Voltage (Max): 75V; Description: 电阻类型:厚膜电阻;阻值:10kΩ;精度:±1%;功率:100mW;温度系数:±100ppm/℃;最大工作电压:75V;工作温度范围:-55℃~+155℃;; Symbol: 0603WAF1002T5E; Device: 0603WAF1002T5E; Supplier: LCSC; Manufacturer Part: 0603WAF1002T5E; Supplier Part: C25804; JLCPCB Part Class: Basic Part; LCSC Part Name: 10kΩ ±1% 100mW; Supplier Footprint: 0603; Datasheet: https://atta.szlcsc.com/upload/public/pdf/source/20200306/C422600_1E6D84923E4A46A82E41ADD87F860B5C.pdf; Convert to PCB: yes; Type: 厚膜电阻; Operating Temperature Range: -55℃~+155℃
  R25 R34 R52-R54: Name: 10kΩ; Value: 10kΩ
  R57: Name: 100kΩ; Value: 100kΩ
R27 = 0603WAF220JT5E: Manufacturer: UNI-ROYAL(厚声); Symbol: 电阻; Add into BOM: yes; Tolerance: ±1%; Power(Watts): 100mW; Overload Voltage (Max): 75V; Temperature Coefficient: ±100ppm/℃; Description: 阻值:22Ω;精度:±1%;功率:100mW;温度系数:±100ppm/℃;电阻类型:厚膜电阻;; Name: 22Ω; Device: 0603WAF220JT5E; LCSC Part Name: 22Ω ±1% 100mW 厚膜电阻; Supplier Part: C23345; Manufacturer Part: 0603WAF220JT5E; Supplier Footprint: 0603; JLCPCB Part Class: Basic Part; Datasheet: https://atta.szlcsc.com/upload/public/pdf/source/20200306/C422600_1E6D84923E4A46A82E41ADD87F860B5C.pdf; Supplier: LCSC; Convert to PCB: yes; Value: 22Ω; Type: 厚膜电阻; Operating Temperature Range: -55℃~+155℃
R31 R32 = 0603WAF1001T5E: Manufacturer: UNI-ROYAL(厚声); Add into BOM: yes; Tolerance: ±1%; Power(Watts): 100mW; Overload Voltage (Max): 75V; Temperature Coefficient: ±100ppm/℃; Description: 阻值:1kΩ;精度:±1%;功率:100mW;温度系数:±100ppm/℃;电阻类型:厚膜电阻;; Name: 1kΩ; Symbol: 0603WAF1001T5E; Device: 0603WAF1001T5E; Supplier: LCSC; Manufacturer Part: 0603WAF1001T5E; Supplier Part: C21190; Value: 1kΩ; JLCPCB Part Class: Basic Part; LCSC Part Name: 1kΩ ±1% 100mW 厚膜电阻; Supplier Footprint: 0603; Datasheet: https://atta.szlcsc.com/upload/public/pdf/source/20200306/C422600_1E6D84923E4A46A82E41ADD87F860B5C.pdf; Convert to PCB: yes; Type: 厚膜电阻; Operating Temperature Range: -55℃~+155℃
R33 R44 = 0603WAF3001T5E: Manufacturer: UNI-ROYAL(厚声); Add into BOM: yes; Tolerance: ±1%; Power(Watts): 100mW; Overload Voltage (Max): 75V; Temperature Coefficient: ±100ppm/℃; Description: 阻值:3kΩ;精度:±1%;功率:100mW;温度系数:±100ppm/℃;电阻类型:厚膜电阻;; Name: 3kΩ; Symbol: 0603WAF3001T5E; Device: 0603WAF3001T5E; Supplier: LCSC; Manufacturer Part: 0603WAF3001T5E; Supplier Part: C4211; Value: 3kΩ; JLCPCB Part Class: Basic Part; LCSC Part Name: 3kΩ ±1% 100mW 厚膜电阻; Supplier Footprint: 0603; Datasheet: https://atta.szlcsc.com/upload/public/pdf/source/20200306/C422600_1E6D84923E4A46A82E41ADD87F860B5C.pdf; Convert to PCB: yes; Type: 厚膜电阻; Operating Temperature Range: -55℃~+155℃
R37 = 0603WAF100JT5E: Manufacturer: UNI-ROYAL(厚声); Add into BOM: yes; Tolerance: ±1%; Power(Watts): 100mW; Overload Voltage (Max): 75V; Temperature Coefficient: ±400ppm/℃; Description: 阻值:10Ω;精度:±1%;功率:100mW;温度系数:±400ppm/℃;电阻类型:厚膜电阻;; Name: 10Ω; Symbol: 0603WAF100JT5E; Device: 0603WAF100JT5E; Supplier: LCSC; Manufacturer Part: 0603WAF100JT5E; Supplier Part: C22859; Value: 10Ω; JLCPCB Part Class: Basic Part; LCSC Part Name: 10Ω ±1% 100mW 厚膜电阻; Supplier Footprint: 0603; Datasheet: https://atta.szlcsc.com/upload/public/pdf/source/20200306/C422600_1E6D84923E4A46A82E41ADD87F860B5C.pdf; Convert to PCB: yes; Type: 厚膜电阻; Operating Temperature Range: -55℃~+155℃
R61 R62 = 0603WAF5101T5E: Manufacturer: UNI-ROYAL(厚声); Add into BOM: yes; Tolerance: ±1%; Power(Watts): 100mW; Overload Voltage (Max): 75V; Temperature Coefficient: ±100ppm/℃; Description: 电阻类型:厚膜电阻;阻值:5.1kΩ;精度:±1%;功率:100mW;最大工作电压:75V;温度系数:±100ppm/℃;; Name: 5.1kΩ; Symbol: 0603WAF5101T5E; Device: 0603WAF5101T5E; Supplier: LCSC; Manufacturer Part: 0603WAF5101T5E; Supplier Part: C23186; Value: 5.1kΩ; JLCPCB Part Class: 基础库; LCSC Part Name: 5.1kΩ ±1% 100mW 厚膜电阻; Supplier Footprint: 0603; Datasheet: https://atta.szlcsc.com/upload/public/pdf/source/20200306/C422600_1E6D84923E4A46A82E41ADD87F860B5C.pdf; Convert to PCB: yes; Type: 厚膜电阻; Operating Temperature Range: -55℃~+155℃
SW1 SW12 SW18 = MSK12C02: Manufacturer: SHOU HAN(首韩); Add into BOM: yes; Circuit: 单刀双掷; Pin Style: SMD接片; Switch Length: 8mm; Switch Width: 2.8mm; Switch Height: 1.4mm; Current Rating (DC): 50mA; Voltage Rating (DC): 12V; Mechanical Life: 1万次; Description: 电路结构:单刀双掷;安装方式:卧贴;开关颜色:-;额定电流(DC):50mA;额定电压(DC):12V;额定电流(AC):-;额定电压(AC):-;机械寿命:1万次;; Name: MSK12C02; Symbol: MSK12C02; Device: MSK12C02; Supplier: LCSC; Supplier Part: C431540; Manufacturer Part: MSK12C02; JLCPCB Part Class: Extended Part; LCSC Part Name: 两档侧拨贴片 7脚 滑动开关; Supplier Footprint: SMD; Datasheet: https://atta.szlcsc.com/upload/public/pdf/source/20190925/C431540_89155AEF0758B9AD1B2D805F83FB12E3.pdf; Convert to PCB: yes; Actuator Style: -; Mounting Style: 卧贴; Actuator Color: -; Current Rating (AC): -; Voltage Rating (AC): -; Operating Temperature: -20℃~+70℃
U1 = F1C200S: Manufacturer: Allwinner(全志); Add into BOM: yes; Description: CPU内核:-;CPU最大主频:-;程序存储容量:-;程序存储器类型:-;RAM总容量:-;GPIO端口数量:-;ADC(位数):-;工作温度范围:-;; Name: F1C200S; Symbol: F1C200S; Device: F1C200S; LCSC Part Name: Allwinner F1C200S Allwinner F1C200S; Supplier Part: C2879851; Manufacturer Part: F1C200S; Supplier Footprint: QFN-88-EP(10x10); JLCPCB Part Class: Extended Part; Datasheet: https://atta.szlcsc.com/upload/public/pdf/source/20211016/C2879851_80200E64F493B5C5B5C583D1EECFE2F1.pdf; Supplier: LCSC; Convert to PCB: yes; CPU Core: -; CPU Maximum Speed: -; Operating Voltage Range: -; Program Storage Size: -; Program Memory Type: -; RAM Size: -; EEPROM: -; GPIO Ports Number: -; ADC (Bit): -; DAC (Bit): -; PWM (Bit): -; 8Bit Timer: -; 16Bit Timer: -; 32Bit Timer: -; CAN: -; UART/USART: -; I2C: -; I2S: -; SPI: -; Universal Serial Bus: -; Internal Comparator: -; Peripheral/Function: -; communication protocol: -; Watchdog: -; Real-Time Clock: -; Infrared Data Association: -; Low-Voltage Detect: -; CCP Capture/Compare: -; LCD Module: -; LED Module: -; Secure Digital Input and Output: -; Direct Memory Access: -; Internal Oscillator: -; Operating Temperature Range: -
U2 U38 = TypeC-16PIN: Add into BOM: yes; Name: TypeC-16PIN; Symbol: TYPEC-16PIN; Device: TypeC-16PIN; LCSC Part Name: TypeC-16PIN; Supplier Part: C9900016187; Manufacturer Part: TypeC-16PIN; Supplier Footprint: TypeC-16PIN; JLCPCB Part Class: Extended Part; Datasheet: 2022-04-26/182445A/86ade1b3bc5841688e69f2c7e7e4613d/TYPEC母座.pdf; Supplier: LCSC; Convert to PCB: yes
U13 = 24m: Symbol: 24M_C9900023050; Add into BOM: yes; Name: 24m; Device: 24m; LCSC Part Name: 24m; Supplier Part: C9900023050; Manufacturer Part: 24m; Supplier Footprint: 晶振3225; JLCPCB Part Class: Extended Part; Supplier: LCSC; Convert to PCB: yes
U14 = TF-015-N: Manufacturer: HanElectricity(瀚源); Add into BOM: yes; Connector Type: 卡座; Description: 连接器类型:卡座;; Name: TF-015-N; Symbol: TF-015-N; Device: TF-015-N; LCSC Part Name: 卡座; Supplier Part: C5362196; Manufacturer Part: TF-015-N; Supplier Footprint: SMD; Datasheet: https://atta.szlcsc.com/upload/public/pdf/source/20230308/7D3AD6E63E6007917C47AB4204EA4F1F.pdf; Supplier: LCSC; Convert to PCB: yes
U15 = W25Q256JWEIQ_C2940048: Manufacturer: WINBOND(华邦); Add into BOM: yes; Name: W25Q256JWEIQ; Symbol: W25Q256JWEIQ; Device: W25Q256JWEIQ_C2940048; LCSC Part Name: W25Q256JWEIQ; Supplier Part: C2940048; Manufacturer Part: W25Q256JWEIQ; Supplier Footprint: WSON-8-EP(6x8); JLCPCB Part Class: Extended Part; Datasheet: https://atta.szlcsc.com/upload/public/pdf/source/20220117/CDD09BFA0A44F679CA0D9C81005E0A19.pdf; Supplier: LCSC; Convert to PCB: yes
U23 = EA3036: Add into BOM: yes; Name: EA3036; Symbol: EA3036; Device: EA3036; LCSC Part Name: EA3036; Supplier Part: C9900004757; Manufacturer Part: EA3036; Supplier Footprint: QFN-20_L3.0-W3.0-P0.40-EP1.7; JLCPCB Part Class: Extended Part; Datasheet: https://atta.szlcsc.comnull; Supplier: LCSC; Convert to PCB: yes
U25 = XC6206P302MR_C347375: 输出类型:固定;输出极性:正;最大输入电压:8V;输出电压:3V;输出电流:250mA;电源纹波抑制比(PSRR):40dB@(1kHz);; Manufacturer: UMW(友台半导体); Add into BOM: yes; Output Type: 固定; Output Polarity: 正; Number of Outputs: 1; Maximum Input Voltage: 8V; Output Voltage: 3V; Dropout Voltage: 240mV@(50mA); Output Current: 250mA; Name: XC6206P302MR; Symbol: XC6206P302MR_C347375; Device: XC6206P302MR_C347375; LCSC Part Name: 输入8V 输出3V 250mA; Supplier Part: C347375; Manufacturer Part: XC6206P302MR; Supplier Footprint: SOT-23(TO-236); JLCPCB Part Class: Extended Part; Datasheet: https://atta.szlcsc.com/upload/public/pdf/source/20211011/2FF0EF86CD1346BC1578534D6C1D0E45.pdf; Supplier: LCSC; Convert to PCB: yes; Power Supply Rejection Ratio (PSRR): 40dB@(1kHz); Quiescent Current (Ground Current): -; Noise: -; Feature: -; Operating Temperature: -25℃~+80℃
U26 = LGS5500DA: Manufacturer: Legend-Si(棱晶半导体); Add into BOM: yes; Type of Battery: 锂离子/聚合物; The Chip Type: 电池充放电管理; Number of Cells: 1; Maximum Charge Current: 1A; Supply Voltage: 4.5V~5.5V; Charging Saturation Voltage: 4.35V；4.4V；4.3V；4.2V; End-Off Voltage: 2.9V; Description: 电池类型:锂离子/聚合物;电池节数:1;最大充电电流:1A;电源电压:4.5V~5.5V;; Name: LGS5500DA; Symbol: LGS5500DA; Device: LGS5500DA; Supplier: LCSC; Supplier Part: C5280700; Manufacturer Part: LGS5500DA; JLCPCB Part Class: Extended Part; LCSC Part Name: 1A充电,0.3A同步升压放电,超低待机2uA+的TP5400,ETA9697; Supplier Footprint: DFN-8(2x2); Datasheet: https://atta.szlcsc.com/upload/public/pdf/source/20230407/FCD039C21EAAD2C20B987E5BAB1B60C9.pdf; Convert to PCB: yes; Operating Temperature: -40℃~+125℃
U27 = 2.0寸ips: Add into BOM: yes; Symbol: 2.0寸ips; Device: 2.0寸ips; Convert to PCB: yes
U28 = UART2.54: Add into BOM: yes; Symbol: UART2.54; Device: UART2.54; Convert to PCB: yes
U29 = ir: Add into BOM: yes; Symbol: ir; Device: ir; Convert to PCB: yes
U30 = bat: Add into BOM: yes; Symbol: bat; Device: bat; Convert to PCB: yes
U31 U33 U35 = MSUSB30: Manufacturer: 杭州瑞盟; Add into BOM: yes; Description: 开关电路:-;多路复用器/解复用器电路:-;导通电阻（最大值）:-;开关电压（最大值）:-;; Symbol: MSUSB30; Device: MSUSB30; LCSC Part Name: MSUSB30; Supplier Part: C231929; Supplier Footprint: MSOP-10; JLCPCB Part Class: 扩展库; Datasheet: https://atta.szlcsc.com/upload/public/pdf/source/20180622/C231929_BD04D8426AD4C0B5A7BE8D2A9C97FC46.pdf; Supplier: LCSC; Convert to PCB: yes; Switch Circuit: -; Multiplexer/Demultiplexer Circuit: -; Number of Circuits: -; On Resistance (Max): -; Switch Voltage (Max): -; On Time (Max): -; Off Time (Max): -; Supply Voltage: -; Operating Temperature: -
  U31: Name: SEL2; Manufacturer Part: SEL2
  U33: Name: SEL1; Manufacturer Part: SEL1
  U35: Name: SEL0; Manufacturer Part: SEL0
U32 = SL2.1A: Manufacturer: CoreChips(和芯润德); Add into BOM: yes; Applications Function: 集线器; Description: 应用功能:集线器;接口协议:-;; Name: HUB; Symbol: SL2.1A; Device: SL2.1A; LCSC Part Name: SL2.1A USB2.0 HUB 控制器集成电路; Supplier Part: C192893; Manufacturer Part: HUB; Supplier Footprint: SOP-16; JLCPCB Part Class: 扩展库; Datasheet: https://atta.szlcsc.com/upload/public/pdf/source/20180522/C192893_624110D24898D57AAC785E3DF98EA862.pdf; Supplier: LCSC; Convert to PCB: yes; Protocol: -
U34 = SIQ-02FVS3: Manufacturer: MITSUMI(美上美); Add into BOM: yes; Name: SIQ-02FVS3; Symbol: SIQ-02FVS3; Device: SIQ-02FVS3; LCSC Part Name: 拨轮滚轮旋转编码器开关; Supplier Part: C2925423; Manufacturer Part: SIQ-02FVS3; Supplier Footprint: SMD; JLCPCB Part Class: 扩展库; Datasheet: https://atta.szlcsc.com/upload/public/pdf/source/20220728/2FBC1A98A06DC86460FC69DAE20456FC.pdf; Supplier: LCSC; Convert to PCB: yes
U37 = SI2301-ZE: Manufacturer: HXY MOSFET(华轩阳电子); Add into BOM: yes; Drain Source Voltage (Vdss): 20V; Continuous Drain Current (Id): 2.3A; Power Dissipation (Pd): 700mW; Drain Source On Resistance (RDS(on)@Vgs,Id): 126mΩ@4.5V; Gate Threshold Voltage (Vgs(th)@Id): 1V@250uA; Input Capacitance (Ciss@Vds): 285pF; Description: 类型:P沟道;漏源电压(Vdss):20V;连续漏极电流(Id):2.3A;功率(Pd):700mW;导通电阻(RDS(on)@Vgs,Id):126mΩ@4.5V;阈值电压(Vgs(th)@Id):1V@250uA;; Name: SI2301-ZE; Symbol: SI2301-ZE; Device: SI2301-ZE; LCSC Part Name: P沟道 耐压:20V 电流:2.3A; Supplier Part: C5261052; Manufacturer Part: SI2301-ZE; Supplier Footprint: SOT-23; JLCPCB Part Class: 扩展库; Datasheet: https://atta.szlcsc.com/upload/public/pdf/source/20230515/2FF2907841563ED329594D3237822724.pdf; Supplier: LCSC; Convert to PCB: yes; Type: P沟道
X1 = X322512MSB4SI: Manufacturer: YXC(扬兴晶振); Add into BOM: yes; Crystal Type: 贴片晶振; Normal temperature Frequency Tolerance: ±10ppm; External load capacitor: 20pF; Frequency Stability(Full temperature range): ±20ppm; Description: 晶振类型:贴片晶振;频率:12MHz;常温频差:±10ppm;外接负载电容:20pF;频率稳定度(全温):±20ppm;; Name: 12MHz; Symbol: X322512MSB4SI; Device: X322512MSB4SI; LCSC Part Name: 12MHz ±10ppm 20pF; Supplier Part: C9002; Manufacturer Part: X322512MSB4SI; Supplier Footprint: SMD3225-4P; JLCPCB Part Class: 基础库; Datasheet: https://atta.szlcsc.com/upload/public/pdf/source/20240329/19D5F850207469550BEB00D7DFEDBC7A.pdf; Supplier: LCSC; Convert to PCB: yes; Value: 12MHz; Operating Temperature: -40℃~+85℃